# EAGLE design spacing (EAGLE 9.3.0)
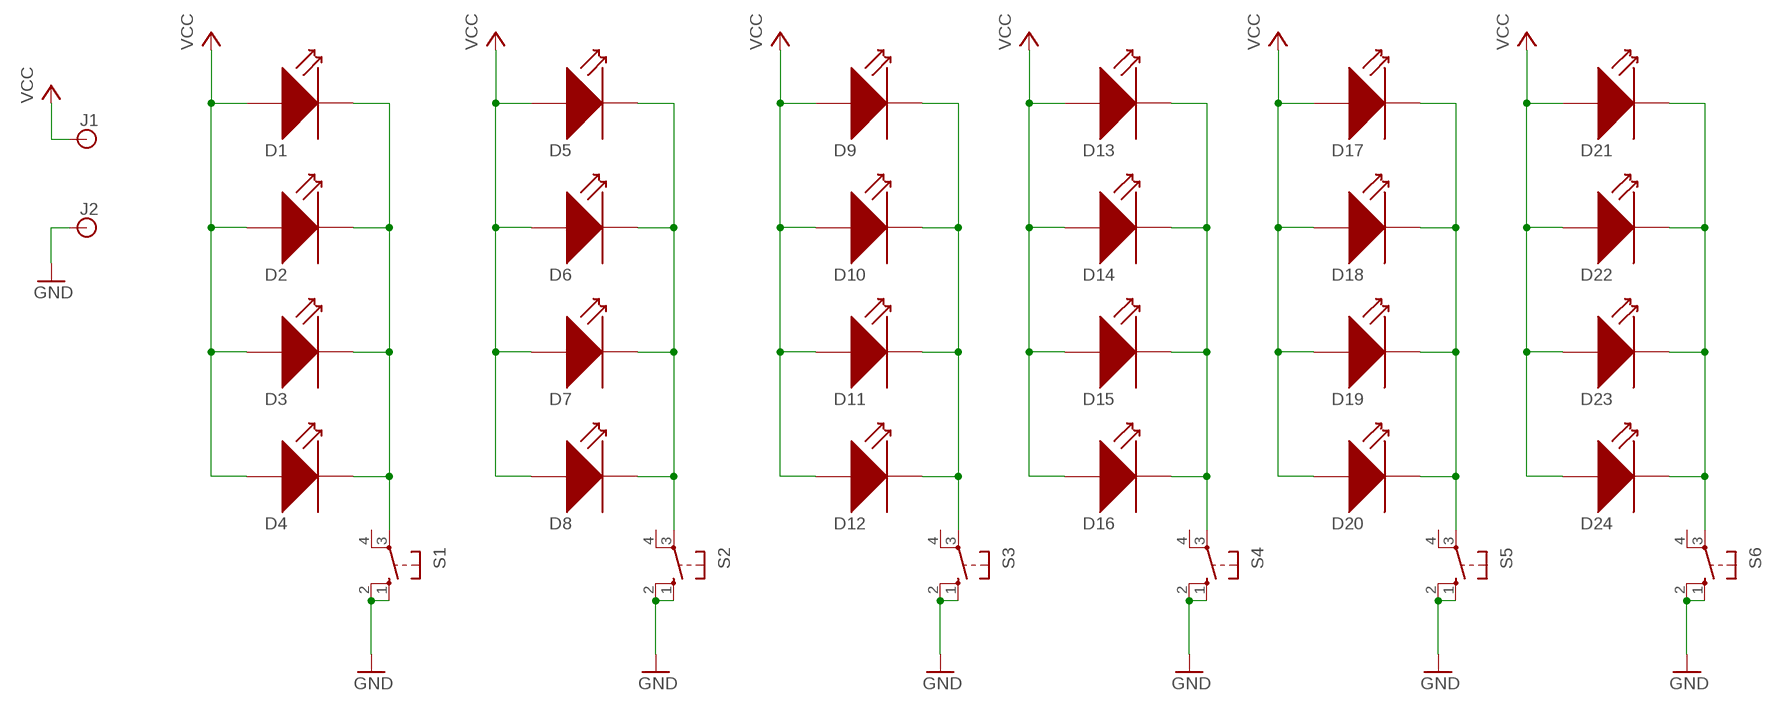
[diagram p0: schematic, sheet 1]

## Parts
D1  NVSLE21AT  [NVSLE21AT]
D2  NVSLE21AT  [NVSLE21AT]
D3  NVSLE21AT  [NVSLE21AT]
D4  NVSLE21AT  [NVSLE21AT]
D5  NVSLE21AT  [NVSLE21AT]
D6  NVSLE21AT  [NVSLE21AT]
D7  NVSLE21AT  [NVSLE21AT]
D8  NVSLE21AT  [NVSLE21AT]
D9  NVSLE21AT  [NVSLE21AT]
D10  NVSLE21AT  [NVSLE21AT]
D11  NVSLE21AT  [NVSLE21AT]
D12  NVSLE21AT  [NVSLE21AT]
D13  NVSLE21AT  [NVSLE21AT]
D14  NVSLE21AT  [NVSLE21AT]
D15  NVSLE21AT  [NVSLE21AT]
D16  NVSLE21AT  [NVSLE21AT]
D17  NVSLE21AT  [NVSLE21AT]
D18  NVSLE21AT  [NVSLE21AT]
D19  NVSLE21AT  [NVSLE21AT]
D20  NVSLE21AT  [NVSLE21AT]
D21  NVSLE21AT  [NVSLE21AT]
D22  NVSLE21AT  [NVSLE21AT]
D23  NVSLE21AT  [NVSLE21AT]
D24  NVSLE21AT  [NVSLE21AT]
J1  BANANA_CONN  [BANANA_CONN]
J2  BANANA_CONN  [BANANA_CONN]
S1  10-XX  [B3F-10XX]
S2  10-XX  [B3F-10XX]
S3  10-XX  [B3F-10XX]
S4  10-XX  [B3F-10XX]
S5  10-XX  [B3F-10XX]
S6  10-XX  [B3F-10XX]

## Nets
GND: J2.P$1 S1.1(S) S1.2(S1) S2.1(S) S2.2(S1) S3.1(S) S3.2(S1) S4.1(S) S4.2(S1) S5.1(S) S5.2(S1) S6.1(S) S6.2(S1)
N$1: D17.P$1(CATHODE) D18.P$1(CATHODE) D19.P$1(CATHODE) D20.P$1(CATHODE) S5.3(P)
N$2: D1.P$1(CATHODE) D2.P$1(CATHODE) D3.P$1(CATHODE) D4.P$1(CATHODE) S1.3(P)
N$3: D21.P$1(CATHODE) D22.P$1(CATHODE) D23.P$1(CATHODE) D24.P$1(CATHODE) S6.3(P)
N$4: D5.P$1(CATHODE) D6.P$1(CATHODE) D7.P$1(CATHODE) D8.P$1(CATHODE) S2.3(P)
N$5: D9.P$1(CATHODE) D10.P$1(CATHODE) D11.P$1(CATHODE) D12.P$1(CATHODE) S3.3(P)
N$6: D13.P$1(CATHODE) D14.P$1(CATHODE) D15.P$1(CATHODE) D16.P$1(CATHODE) S4.3(P)
VCC: D1.P$2(ANODE) D2.P$2(ANODE) D3.P$2(ANODE) D4.P$2(ANODE) D5.P$2(ANODE) D6.P$2(ANODE) D7.P$2(ANODE) D8.P$2(ANODE) D9.P$2(ANODE) D10.P$2(ANODE) D11.P$2(ANODE) D12.P$2(ANODE) D13.P$2(ANODE) D14.P$2(ANODE) D15.P$2(ANODE) D16.P$2(ANODE) D17.P$2(ANODE) D18.P$2(ANODE) D19.P$2(ANODE) D20.P$2(ANODE) D21.P$2(ANODE) D22.P$2(ANODE) D23.P$2(ANODE) D24.P$2(ANODE) J1.P$1
Unconnected: S1.4(P1) S2.4(P1) S3.4(P1) S4.4(P1) S5.4(P1) S6.4(P1)

## Library data of the parts
D1-D24 = leds:NVSLE21AT
J1 J2 = SparkFun-Connectors:BANANA_CONN: Through-hole Banana Jack Basic PTH connection for banana jack plugs SparkFun Products: Multimeter Kit <https://www.sparkfun.com/products/retired/10956> Banana to Alligator Cable <https://www.sparkfun.com/products/retired/509> Banana to Alligator Coax Cable <https://www.sparkfun.com/products/retired/508> Banana to Banana Cable <https://www.sparkfun.com/products/retired/507> Banana to IC Hook Cables <https://www.sparkfun.com/products/retired/506>
S1-S6 = switch-omron:10-XX: OMRON SWITCH; MPN: B3F-1000; OC_FARNELL: 176432; OC_NEWARK: 36M3542

## Board
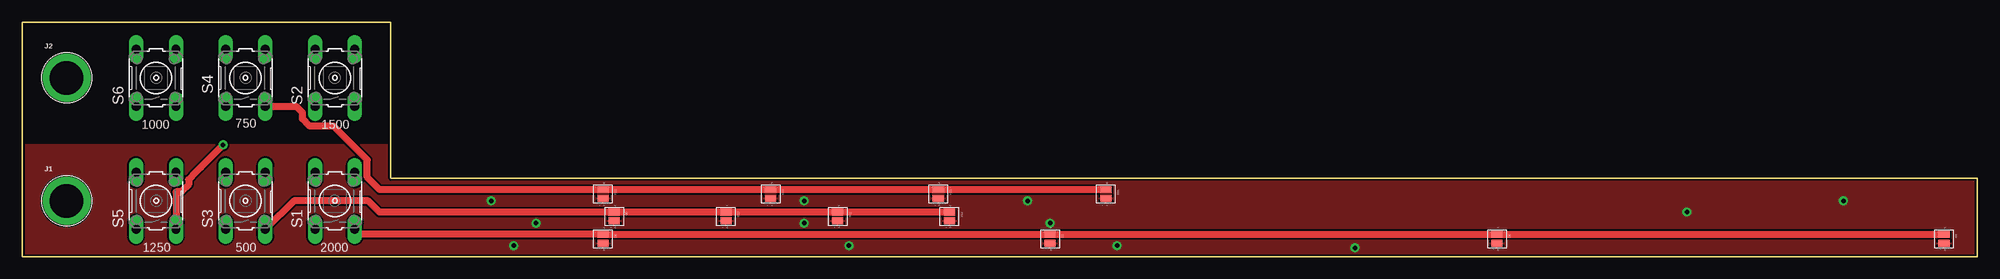
[diagram p1: board, top side]
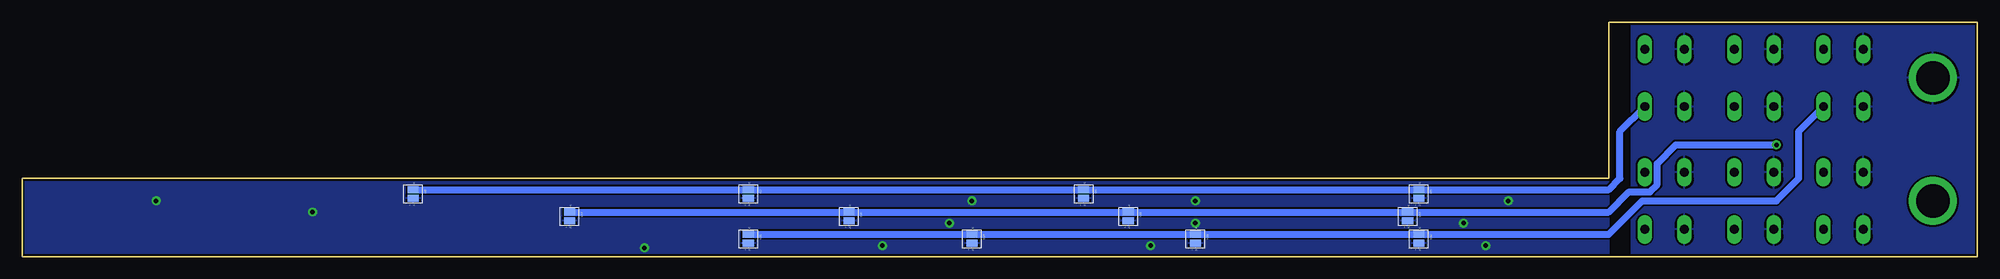
[diagram p2: board, bottom side, seen from below]

Size 222.25 x 26.67 mm. Coordinates in mm from the lower left corner, seen from the top.
Outline: 0,0 222.25,0 222.25,8.89 41.91,8.89 41.91,26.67 0,26.67 0,0
Copper layers (1*16): Top 0.035mm / dielectric 1.5mm / Bottom 0.035mm
Design rules "SparkFun": minimum track width 8mil, minimum drill 20mil, track to track 8mil, track to pad 8mil, pad to pad 8mil, via to via 8mil, smd to smd 8mil, copper to edge 8mil, drill to drill 8mil, minimum pad ring 12mil, minimum via ring 10mil, stop-mask expansion 4mil, vias tented up to drill 20mil, thermal gap 10mil

### Footprints (pad centres in the part's own frame; a part is rotated, then mirrored left to right if it is on the bottom)
NVSLE21AT = smd 0.8 x 1.26: P$1 0,0; P$2 1.001,0
BANANA_CONN = drill 3.81 pad 5.461: P$1 0,0
B3F-10XX = drill 1.016 long: 1 -3.251,2.261; 2 3.251,2.261; 3 -3.251,-2.261; 4 3.251,-2.261

### Placement (x,y rotation side)
D1  66.04,2.54 270 top
D2  116.84,2.54 270 top
D3  167.64,2.54 270 top
D4  218.44,2.54 270 top
D5  63.5,7.62 270 bottom
D6  101.6,7.62 270 bottom
D7  139.7,7.62 270 bottom
D8  177.8,7.62 270 bottom
D9  67.31,5.08 270 top
D10  80.01,5.08 270 top
D11  92.71,5.08 270 top
D12  105.41,5.08 270 top
D13  66.04,7.62 270 top
D14  85.09,7.62 270 top
D15  104.14,7.62 270 top
D16  123.19,7.62 270 top
D17  160.02,5.08 270 bottom
D18  64.77,5.08 270 bottom
D19  96.52,5.08 270 bottom
D20  128.27,5.08 270 bottom
D21  139.7,2.54 270 bottom
D22  63.5,2.54 270 bottom
D23  88.9,2.54 270 bottom
D24  114.3,2.54 270 bottom
J1  5.08,6.35 0 top
J2  5.08,20.32 0 top
S1  35.56,6.35 90 top
S2  35.56,20.32 90 top
S3  25.4,6.35 90 top
S4  25.4,20.32 90 top
S5  15.24,6.35 90 top
S6  15.24,20.32 90 top

### Tracks (layer width: path | path; a pad name or v marks a point on that pad's centre or on a via)
GND
  pour Bottom: 0,26.67 0,0 39.37,0 39.37,26.67
N$1  (via drill 0.51)
  Top 0.813: v22.86,12.7 20.32,10.16 19.76,9.6 18.92,8.76 18.92,8.2 18.09,7.37 17.53,7.37 17.5,7.34 S5.3
  Bottom 0.813: D17.P$1 D20.P$1 D19.P$1 D18.P$1 41.91,5.08 39.62,7.37 37.23,7.37 36.4,8.2 36.4,10.59 34.29,12.7 v22.86,12.7
N$2
  Top 0.813: S1.3 38.38,2.54 D1.P$1 D2.P$1 D3.P$1 D4.P$1
N$3
  Bottom 0.813: D21.P$1 D24.P$1 D23.P$1 D22.P$1 41.91,2.54 38.1,6.35 22.86,6.35 20.32,8.89 20.32,14.25 S6.3
N$4
  Bottom 0.813: D8.P$1 D7.P$1 D6.P$1 D5.P$1 41.91,7.62 40.64,8.89 40.64,14.25 S2.3
N$5
  Top 0.813: D12.P$1 D11.P$1 D10.P$1 D9.P$1 40.64,5.08 39.37,6.35 30.91,6.35 S3.3
N$6
  Top 0.813: D16.P$1 D15.P$1 D14.P$1 D13.P$1 40.64,7.62 39.24,9.02 39.24,11 35.41,14.83 32.71,14.83 31.88,15.67 31.88,16.38 31.19,17.07 S4.3
VCC  (via drill 0.51)
  other vias: 189.23,5.08 151.51,1.02 207.01,6.35 124.46,1.27 116.84,3.81 114.3,6.35 88.9,6.35 88.9,3.81 93.98,1.27 58.42,3.81 55.88,1.27 53.34,6.35
  pour Top: 0,12.7 0,0 223.52,0 223.52,12.7
  pour Bottom: 41.91,8.89 41.91,0 224.79,0 224.79,8.89

### Text on the board
tPlace: 750 | 1000 | 1500 | 1250 | 500 | 2000